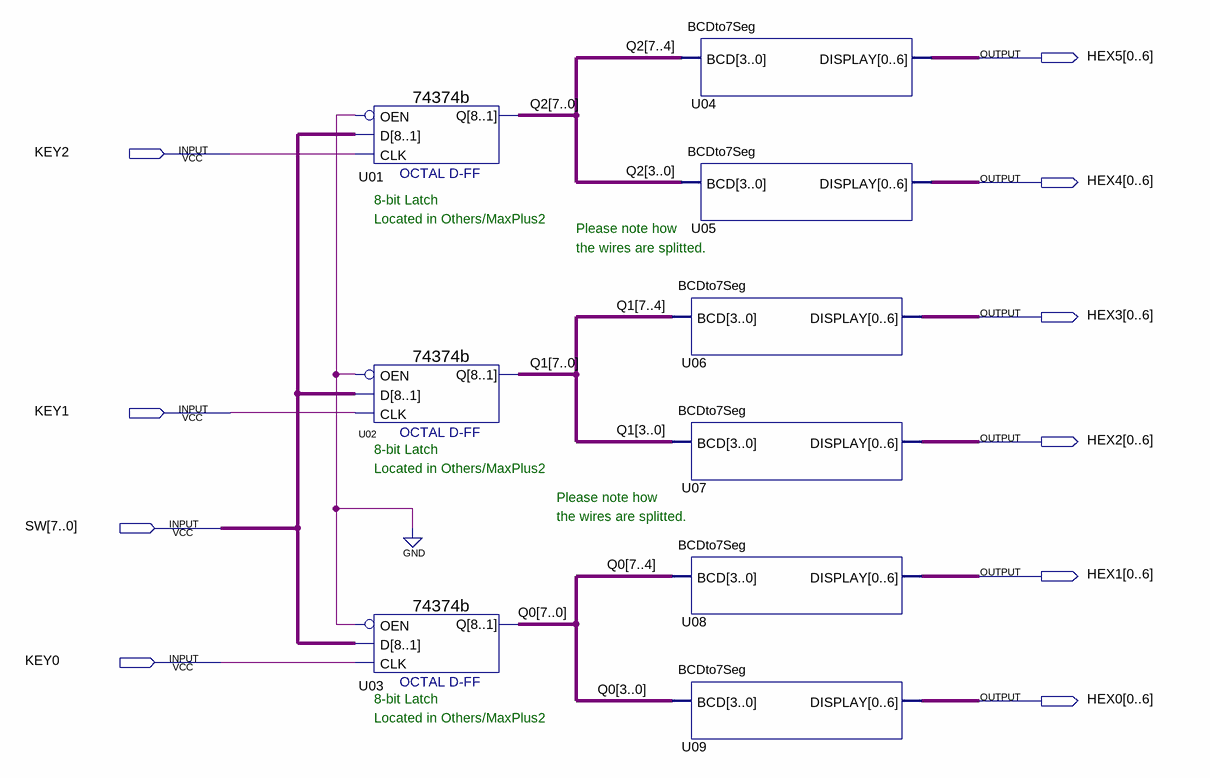
[diagram p0: schematic sheet]
// Quartus schematic LatchExample.bdf as structural Verilog: 9 symbols, 10 pins
module LatchExample (
  input  KEY2,
  input  KEY1,
  input  [7:0] SW,
  input  KEY0,
  output [0:6] HEX5,
  output [0:6] HEX4,
  output [0:6] HEX3,
  output [0:6] HEX2,
  output [0:6] HEX1,
  output [0:6] HEX0
);

  wire [7:0] Q0, Q1, Q2;

  \74374b  U01 (.D(SW), .OEN(1'b0), .CLK(KEY2), .Q(Q2));
  \74374b  U02 (.D(SW), .OEN(1'b0), .CLK(KEY1), .Q(Q1));
  \74374b  U03 (.D(SW), .OEN(1'b0), .CLK(KEY0), .Q(Q0));
  BCDto7Seg U04 (.BCD(Q2[7:4]), .DISPLAY(HEX5));
  BCDto7Seg U05 (.BCD(Q2[3:0]), .DISPLAY(HEX4));
  BCDto7Seg U06 (.BCD(Q1[7:4]), .DISPLAY(HEX3));
  BCDto7Seg U07 (.BCD(Q1[3:0]), .DISPLAY(HEX2));
  BCDto7Seg U08 (.BCD(Q0[7:4]), .DISPLAY(HEX1));
  BCDto7Seg U09 (.BCD(Q0[3:0]), .DISPLAY(HEX0));

  // Notes on the sheet:
  //   8-bit Latch
  //   Located in Others/MaxPlus2
  //   Please note how
  //   the wires are splitted.
  //   8-bit Latch
  //   Located in Others/MaxPlus2
  //   Please note how
  //   the wires are splitted.
  //   8-bit Latch
  //   Located in Others/MaxPlus2
endmodule
